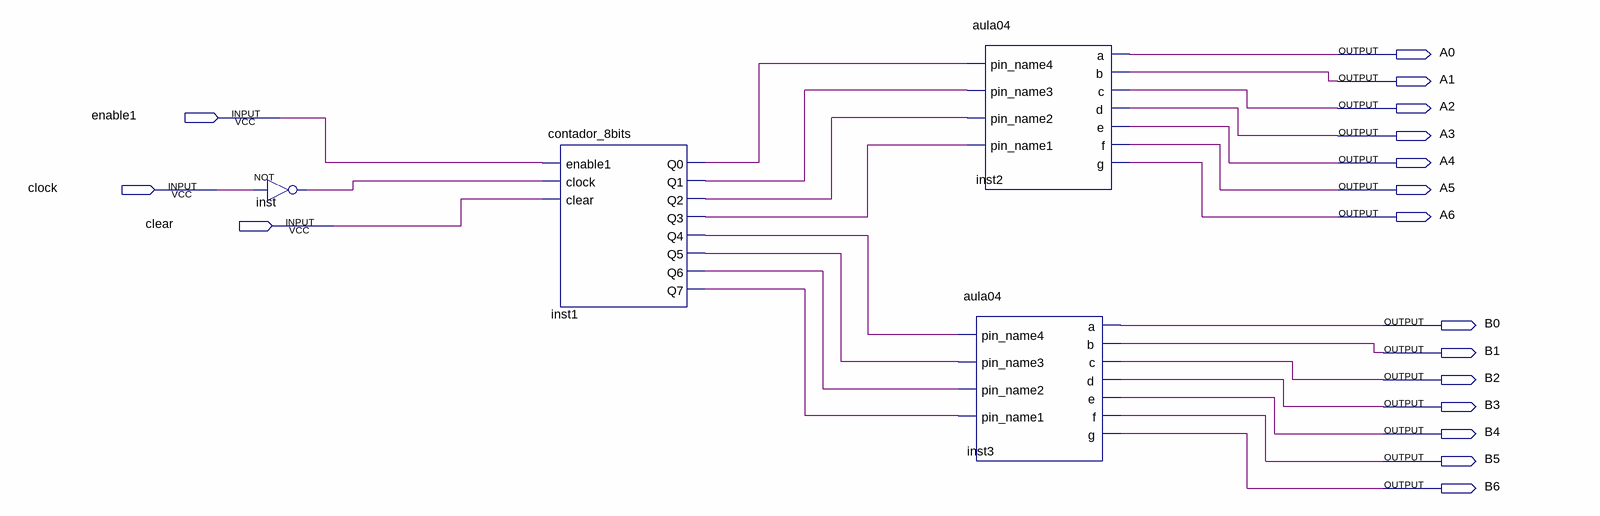
[diagram p0: schematic sheet]
// Quartus schematic parte1.bdf as structural Verilog: 4 symbols, 17 pins
module parte1 (
  input  enable1,
  input  clock,
  input  clear,
  output A0,
  output A1,
  output A2,
  output A3,
  output A4,
  output A5,
  output A6,
  output B0,
  output B1,
  output B2,
  output B3,
  output B4,
  output B5,
  output B6
);

  wire inst1_q0, inst1_q1, inst1_q2, inst1_q3, inst1_q4, inst1_q5, inst1_q6, inst1_q7, inst_out;

  not inst (inst_out, clock);
  contador_8bits inst1 (
    .enable1(enable1), .clock(inst_out), .clear(clear), .Q0(inst1_q0), .Q1(inst1_q1), .Q2(inst1_q2),
    .Q3(inst1_q3), .Q4(inst1_q4), .Q5(inst1_q5), .Q6(inst1_q6), .Q7(inst1_q7));
  aula04 inst2 (
    .pin_name1(inst1_q3), .pin_name4(inst1_q0), .pin_name2(inst1_q2), .pin_name3(inst1_q1), .a(A0), .b(A1),
    .c(A2), .d(A3), .e(A4), .f(A5), .g(A6));
  aula04 inst3 (
    .pin_name1(inst1_q7), .pin_name4(inst1_q4), .pin_name2(inst1_q6), .pin_name3(inst1_q5), .a(B0), .b(B1),
    .c(B2), .d(B3), .e(B4), .f(B5), .g(B6));
endmodule
